# Altium schematic sheet DRV8301_inverter.SchDoc
size 594 x 420 mm; SheetNumber: 8; SheetTotal: 9
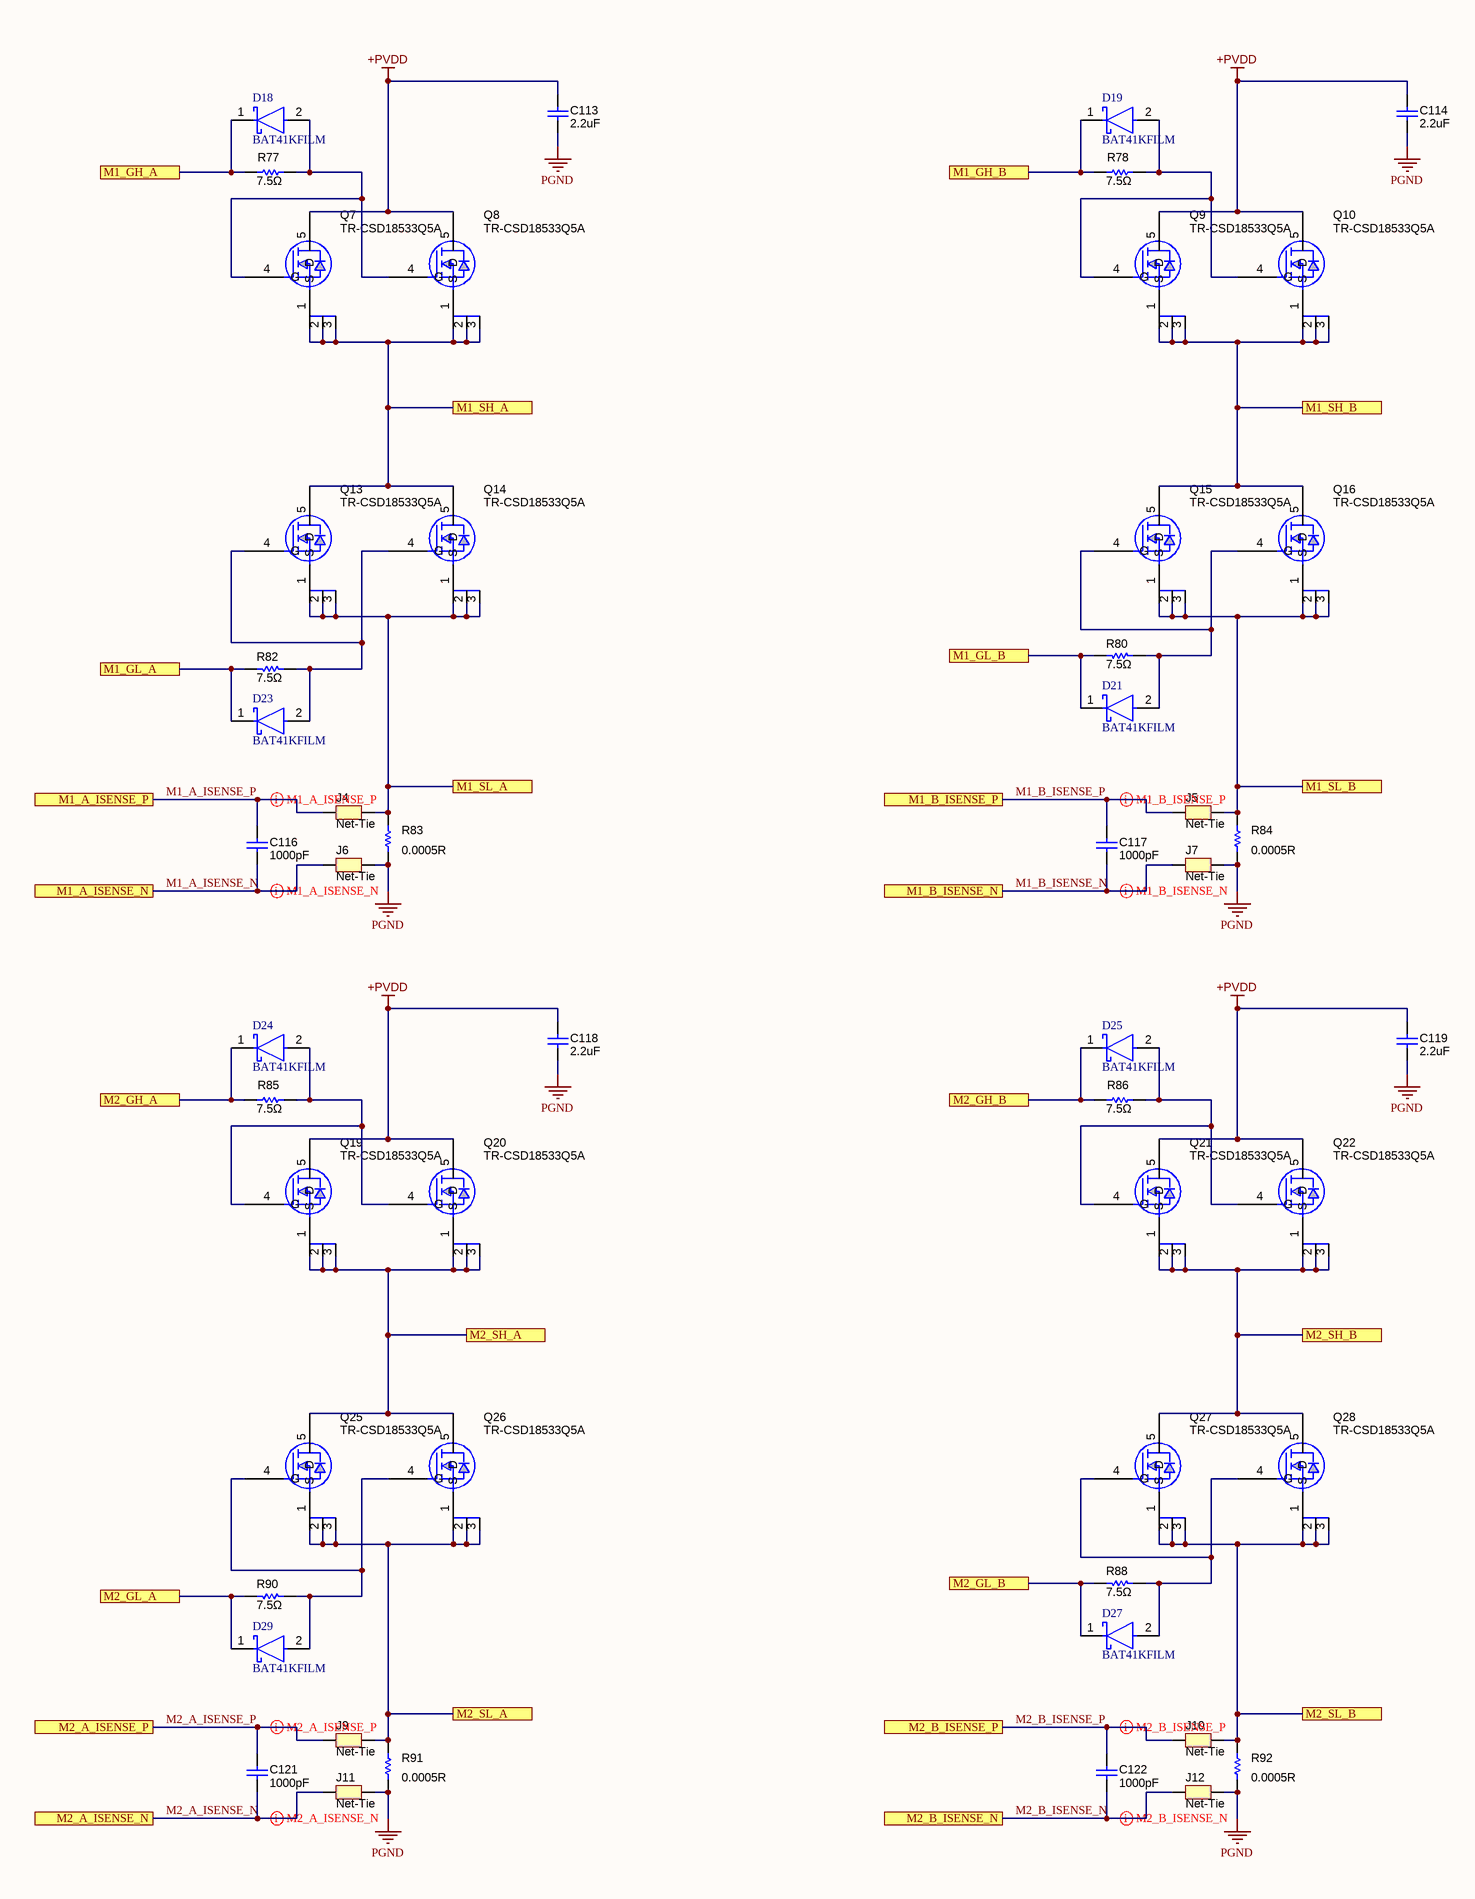
[diagram p0: DRV8301_inverter.SchDoc, left]
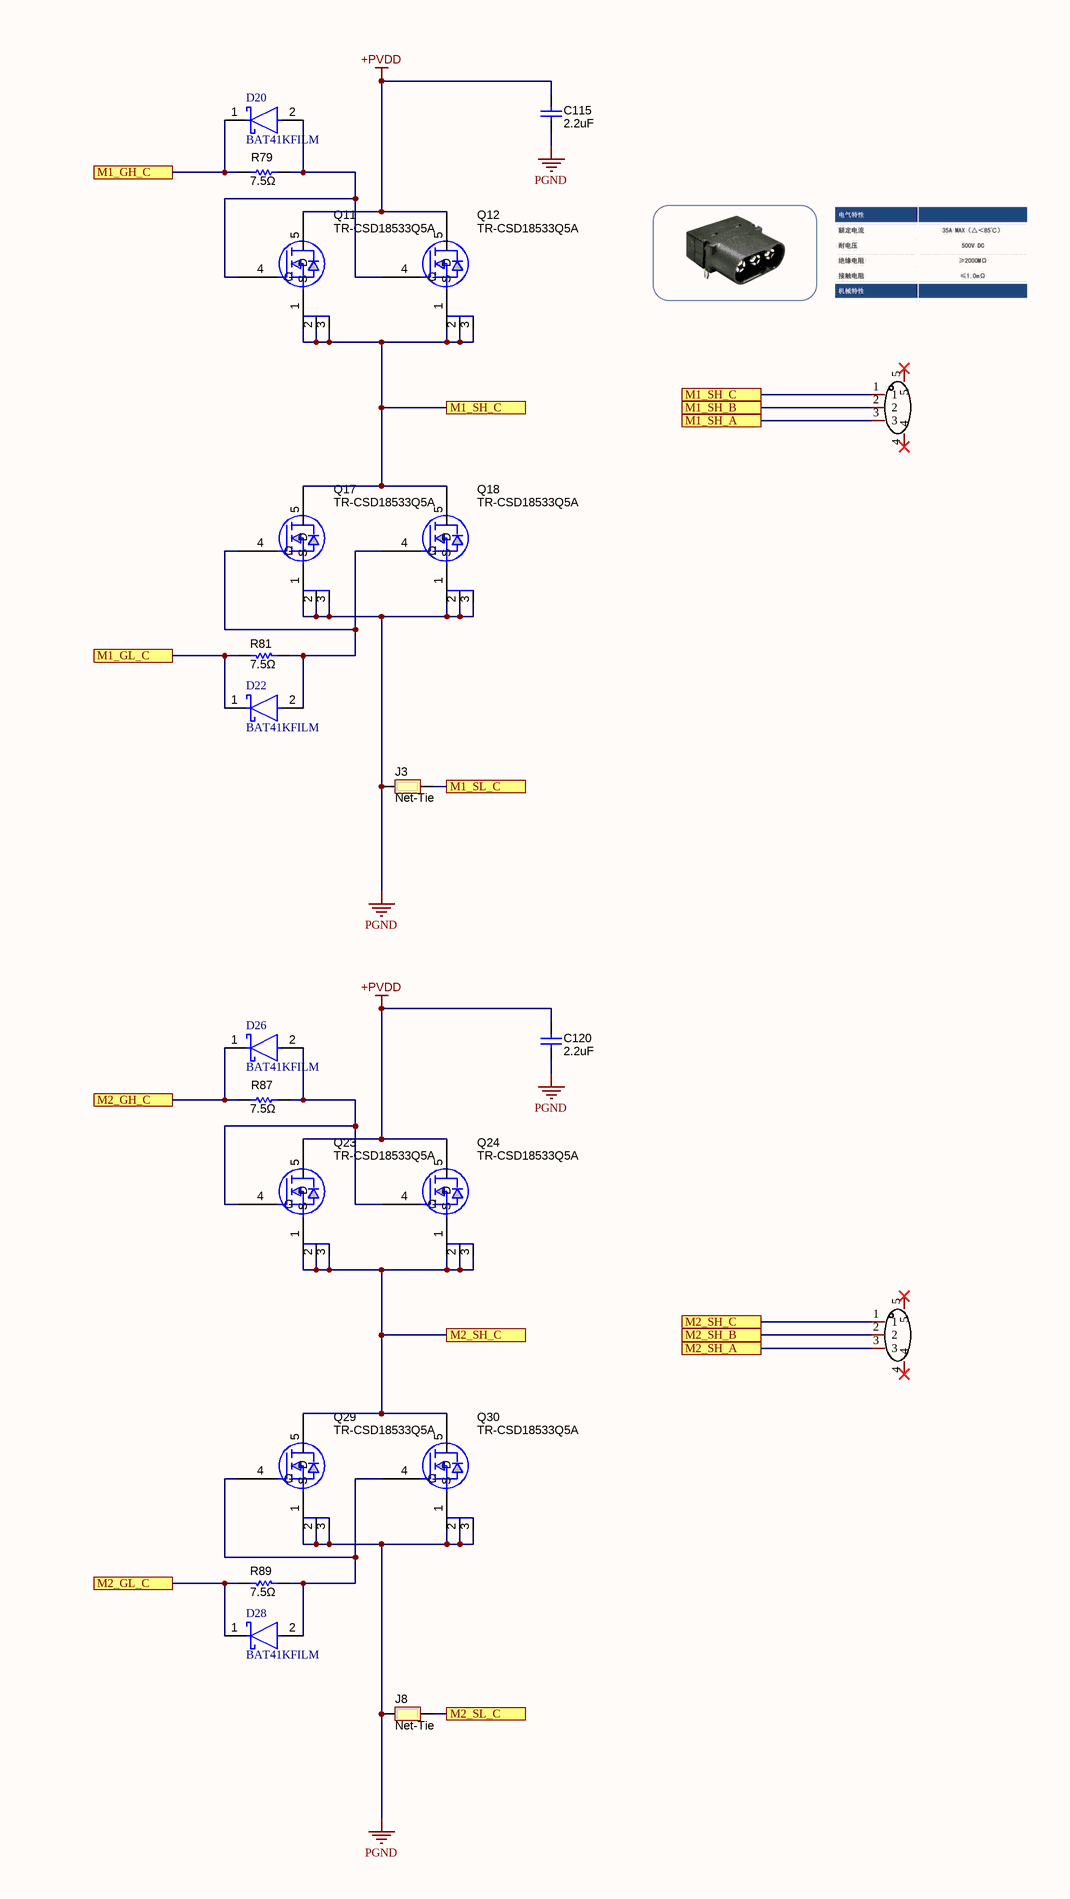
[diagram p1: DRV8301_inverter.SchDoc, right]

## Parts
C113  ValueDisplayed: 2.2uF  [1210L]  (hidden comment: GRM32ER72A225KA35L)
C114  ValueDisplayed: 2.2uF  [1210L]  (hidden comment: GRM32ER72A225KA35L)
C115  ValueDisplayed: 2.2uF  [1210L]  (hidden comment: GRM32ER72A225KA35L)
C116  ValueDisplayed: 1000pF  [0603]  (hidden comment: C0603C102J5GAC)
C117  ValueDisplayed: 1000pF  [0603]  (hidden comment: C0603C102J5GAC)
C118  ValueDisplayed: 2.2uF  [1210L]  (hidden comment: GRM32ER72A225KA35L)
C119  ValueDisplayed: 2.2uF  [1210L]  (hidden comment: GRM32ER72A225KA35L)
C120  ValueDisplayed: 2.2uF  [1210L]  (hidden comment: GRM32ER72A225KA35L)
C121  ValueDisplayed: 1000pF  [0603]  (hidden comment: C0603C102J5GAC)
C122  ValueDisplayed: 1000pF  [0603]  (hidden comment: C0603C102J5GAC)
D18  BAT41KFILM  [FP-SOD-523-MFG]
D19  BAT41KFILM  [FP-SOD-523-MFG]
D20  BAT41KFILM  [FP-SOD-523-MFG]
D21  BAT41KFILM  [FP-SOD-523-MFG]
D22  BAT41KFILM  [FP-SOD-523-MFG]
D23  BAT41KFILM  [FP-SOD-523-MFG]
D24  BAT41KFILM  [FP-SOD-523-MFG]
D25  BAT41KFILM  [FP-SOD-523-MFG]
D26  BAT41KFILM  [FP-SOD-523-MFG]
D27  BAT41KFILM  [FP-SOD-523-MFG]
D28  BAT41KFILM  [FP-SOD-523-MFG]
D29  BAT41KFILM  [FP-SOD-523-MFG]
J3  Net-Tie  [Net-Tie_10mil]  (net tie, no BOM)
J4  Net-Tie  [Net-Tie_10mil]  (net tie, no BOM)
J5  Net-Tie  [Net-Tie_10mil]  (net tie, no BOM)
J6  Net-Tie  [Net-Tie_10mil]  (net tie, no BOM)
J7  Net-Tie  [Net-Tie_10mil]  (net tie, no BOM)
J8  Net-Tie  [Net-Tie_10mil]  (net tie, no BOM)
J9  Net-Tie  [Net-Tie_10mil]  (net tie, no BOM)
J10  Net-Tie  [Net-Tie_10mil]  (net tie, no BOM)
J11  Net-Tie  [Net-Tie_10mil]  (net tie, no BOM)
J12  Net-Tie  [Net-Tie_10mil]  (net tie, no BOM)
Q7  TR-CSD18533Q5A  [QFN5X6MM]
Q8  TR-CSD18533Q5A  [QFN5X6MM]
Q9  TR-CSD18533Q5A  [QFN5X6MM]
Q10  TR-CSD18533Q5A  [QFN5X6MM]
Q11  TR-CSD18533Q5A  [QFN5X6MM]
Q12  TR-CSD18533Q5A  [QFN5X6MM]
Q13  TR-CSD18533Q5A  [QFN5X6MM]
Q14  TR-CSD18533Q5A  [QFN5X6MM]
Q15  TR-CSD18533Q5A  [QFN5X6MM]
Q16  TR-CSD18533Q5A  [QFN5X6MM]
Q17  TR-CSD18533Q5A  [QFN5X6MM]
Q18  TR-CSD18533Q5A  [QFN5X6MM]
Q19  TR-CSD18533Q5A  [QFN5X6MM]
Q20  TR-CSD18533Q5A  [QFN5X6MM]
Q21  TR-CSD18533Q5A  [QFN5X6MM]
Q22  TR-CSD18533Q5A  [QFN5X6MM]
Q23  TR-CSD18533Q5A  [QFN5X6MM]
Q24  TR-CSD18533Q5A  [QFN5X6MM]
Q25  TR-CSD18533Q5A  [QFN5X6MM]
Q26  TR-CSD18533Q5A  [QFN5X6MM]
Q27  TR-CSD18533Q5A  [QFN5X6MM]
Q28  TR-CSD18533Q5A  [QFN5X6MM]
Q29  TR-CSD18533Q5A  [QFN5X6MM]
Q30  TR-CSD18533Q5A  [QFN5X6MM]
R77  value 7.5Ω  [0603L]  (hidden comment: CRCW060310R0JNEA)
R78  value 7.5Ω  [0603L]  (hidden comment: CRCW060310R0JNEA)
R79  value 7.5Ω  [0603L]  (hidden comment: CRCW060310R0JNEA)
R80  value 7.5Ω  [0603L]  (hidden comment: CRCW060310R0JNEA)
R81  value 7.5Ω  [0603L]  (hidden comment: CRCW060310R0JNEA)
R82  value 7.5Ω  [0603L]  (hidden comment: CRCW060310R0JNEA)
R83  value 0.0005R  [2512M]  (hidden comment: CRA2512-FZ-R010ELF)
R84  value 0.0005R  [2512M]  (hidden comment: CRA2512-FZ-R010ELF)
R85  value 7.5Ω  [0603L]  (hidden comment: CRCW060310R0JNEA)
R86  value 7.5Ω  [0603L]  (hidden comment: CRCW060310R0JNEA)
R87  value 7.5Ω  [0603L]  (hidden comment: CRCW060310R0JNEA)
R88  value 7.5Ω  [0603L]  (hidden comment: CRCW060310R0JNEA)
R89  value 7.5Ω  [0603L]  (hidden comment: CRCW060310R0JNEA)
R90  value 7.5Ω  [0603L]  (hidden comment: CRCW060310R0JNEA)
R91  value 0.0005R  [2512M]  (hidden comment: CRA2512-FZ-R010ELF)
R92  value 0.0005R  [2512M]  (hidden comment: CRA2512-FZ-R010ELF)
U25  MR60PW-M.G.B  [CONN-TH_MR60PW]  (value not drawn)
U26  MR60PW-M.G.B  [CONN-TH_MR60PW]  (value not drawn)

## Ports
M1_A_ISENSE_N (see STM32G4_DRV8301_hardware_TOP_V1.0[6D], M1_DRV8301_driver[6D]), M1_A_ISENSE_P (see STM32G4_DRV8301_hardware_TOP_V1.0[6D], M1_DRV8301_driver[6D]), M1_B_ISENSE_N (see STM32G4_DRV8301_hardware_TOP_V1.0[6D], M1_DRV8301_driver[6D]), M1_B_ISENSE_P (see STM32G4_DRV8301_hardware_TOP_V1.0[6D], M1_DRV8301_driver[6D]), M1_GH_A (see STM32G4_DRV8301_hardware_TOP_V1.0[6C], M1_DRV8301_driver[6C]), M1_GH_B (see STM32G4_DRV8301_hardware_TOP_V1.0[6C], M1_DRV8301_driver[6C]), M1_GH_C (see STM32G4_DRV8301_hardware_TOP_V1.0[6C], M1_DRV8301_driver[6D]), M1_GL_A (see STM32G4_DRV8301_hardware_TOP_V1.0[6C], M1_DRV8301_driver[6C]), M1_GL_B (see STM32G4_DRV8301_hardware_TOP_V1.0[6C], M1_DRV8301_driver[6C]), M1_GL_C (see STM32G4_DRV8301_hardware_TOP_V1.0[6D], M1_DRV8301_driver[6D]), M1_SH_A (see STM32G4_DRV8301_hardware_TOP_V1.0[6C], M1_DRV8301_driver[7C]), M1_SH_B (see STM32G4_DRV8301_hardware_TOP_V1.0[6C], M1_DRV8301_driver[7C]), M1_SH_C (see STM32G4_DRV8301_hardware_TOP_V1.0[6D], M1_DRV8301_driver[7D]), M1_SL_A (see STM32G4_DRV8301_hardware_TOP_V1.0[6C], M1_DRV8301_driver[6C]), M1_SL_B (see STM32G4_DRV8301_hardware_TOP_V1.0[6C], M1_DRV8301_driver[6C]), M1_SL_C (see STM32G4_DRV8301_hardware_TOP_V1.0[6D], M1_DRV8301_driver[6D]), M2_A_ISENSE_N (see STM32G4_DRV8301_hardware_TOP_V1.0[6C], M2_DRV8301_driver[7D]), M2_A_ISENSE_P (see STM32G4_DRV8301_hardware_TOP_V1.0[6C], M2_DRV8301_driver[7D]), M2_B_ISENSE_N (see STM32G4_DRV8301_hardware_TOP_V1.0[6C], M2_DRV8301_driver[7D]), M2_B_ISENSE_P (see STM32G4_DRV8301_hardware_TOP_V1.0[6C], M2_DRV8301_driver[7D]), M2_GH_A (see STM32G4_DRV8301_hardware_TOP_V1.0[6B], M2_DRV8301_driver[6C]), M2_GH_B (see STM32G4_DRV8301_hardware_TOP_V1.0[6B], M2_DRV8301_driver[6C]), M2_GH_C (see STM32G4_DRV8301_hardware_TOP_V1.0[6C], M2_DRV8301_driver[6D]), M2_GL_A (see STM32G4_DRV8301_hardware_TOP_V1.0[6B], M2_DRV8301_driver[6C]), M2_GL_B (see STM32G4_DRV8301_hardware_TOP_V1.0[6B], M2_DRV8301_driver[6C]), M2_GL_C (see STM32G4_DRV8301_hardware_TOP_V1.0[6C], M2_DRV8301_driver[6D]), M2_SH_A (see STM32G4_DRV8301_hardware_TOP_V1.0[6B], M2_DRV8301_driver[7C]), M2_SH_B (see STM32G4_DRV8301_hardware_TOP_V1.0[6B], M2_DRV8301_driver[7C]), M2_SH_C (see STM32G4_DRV8301_hardware_TOP_V1.0[6C], M2_DRV8301_driver[7D]), M2_SL_A (see STM32G4_DRV8301_hardware_TOP_V1.0[6B], M2_DRV8301_driver[6C]), M2_SL_B (see STM32G4_DRV8301_hardware_TOP_V1.0[6B], M2_DRV8301_driver[6C]), M2_SL_C (see STM32G4_DRV8301_hardware_TOP_V1.0[6C], M2_DRV8301_driver[6D])

## Nets
+PVDD: C113.1 C114.1 C115.1 C118.1 C119.1 C120.1 Q7.5(D) Q8.5(D) Q9.5(D) Q10.5(D) Q11.5(D) Q12.5(D) Q19.5(D) Q20.5(D) Q21.5(D) Q22.5(D) Q23.5(D) Q24.5(D)
PGND: C113.2 C114.2 C115.2 C118.2 C119.2 C120.2 J3.2 J6.1 J7.1 J8.2 J11.1 J12.1 Q17.1(S) Q17.2 Q17.3 Q18.1(S) Q18.2 Q18.3 Q29.1(S) Q29.2 Q29.3 Q30.1(S) Q30.2 Q30.3 R83.1 R84.1 R91.1 R92.1
M1_A_ISENSE_N: C116.2 J6.2 ; port M1_A_ISENSE_N
M1_A_ISENSE_P: C116.1 J4.2 ; port M1_A_ISENSE_P
M1_B_ISENSE_N: C117.2 J7.2 ; port M1_B_ISENSE_N
M1_B_ISENSE_P: C117.1 J5.2 ; port M1_B_ISENSE_P
M1_GH_A: D18.1(C) R77.1 ; port M1_GH_A
M1_GH_B: D19.1(C) R78.1 ; port M1_GH_B
M1_GH_C: D20.1(C) R79.1 ; port M1_GH_C
M1_GL_A: D23.1(C) R82.1 ; port M1_GL_A
M1_GL_B: D21.1(C) R80.1 ; port M1_GL_B
M1_GL_C: D22.1(C) R81.1 ; port M1_GL_C
M1_SH_A: Q7.1(S) Q7.2 Q7.3 Q8.1(S) Q8.2 Q8.3 Q13.5(D) Q14.5(D) U25.3 ; port M1_SH_A
M1_SH_B: Q9.1(S) Q9.2 Q9.3 Q10.1(S) Q10.2 Q10.3 Q15.5(D) Q16.5(D) U25.2 ; port M1_SH_B
M1_SH_C: Q11.1(S) Q11.2 Q11.3 Q12.1(S) Q12.2 Q12.3 Q17.5(D) Q18.5(D) U25.1 ; port M1_SH_C
M1_SL_A: J4.1 Q13.1(S) Q13.2 Q13.3 Q14.1(S) Q14.2 Q14.3 R83.2 ; port M1_SL_A
M1_SL_B: J5.1 Q15.1(S) Q15.2 Q15.3 Q16.1(S) Q16.2 Q16.3 R84.2 ; port M1_SL_B
M1_SL_C: J3.1 ; port M1_SL_C
M2_A_ISENSE_N: C121.2 J11.2 ; port M2_A_ISENSE_N
M2_A_ISENSE_P: C121.1 J9.2 ; port M2_A_ISENSE_P
M2_B_ISENSE_N: C122.2 J12.2 ; port M2_B_ISENSE_N
M2_B_ISENSE_P: C122.1 J10.2 ; port M2_B_ISENSE_P
M2_GH_A: D24.1(C) R85.1 ; port M2_GH_A
M2_GH_B: D25.1(C) R86.1 ; port M2_GH_B
M2_GH_C: D26.1(C) R87.1 ; port M2_GH_C
M2_GL_A: D29.1(C) R90.1 ; port M2_GL_A
M2_GL_B: D27.1(C) R88.1 ; port M2_GL_B
M2_GL_C: D28.1(C) R89.1 ; port M2_GL_C
M2_SH_A: Q19.1(S) Q19.2 Q19.3 Q20.1(S) Q20.2 Q20.3 Q25.5(D) Q26.5(D) U26.3 ; port M2_SH_A
M2_SH_B: Q21.1(S) Q21.2 Q21.3 Q22.1(S) Q22.2 Q22.3 Q27.5(D) Q28.5(D) U26.2 ; port M2_SH_B
M2_SH_C: Q23.1(S) Q23.2 Q23.3 Q24.1(S) Q24.2 Q24.3 Q29.5(D) Q30.5(D) U26.1 ; port M2_SH_C
M2_SL_A: J9.1 Q25.1(S) Q25.2 Q25.3 Q26.1(S) Q26.2 Q26.3 R91.2 ; port M2_SL_A
M2_SL_B: J10.1 Q27.1(S) Q27.2 Q27.3 Q28.1(S) Q28.2 Q28.3 R92.2 ; port M2_SL_B
M2_SL_C: J8.1 ; port M2_SL_C
NetD18_2: D18.2(A) Q7.4(G) Q8.4(G) R77.2
NetD19_2: D19.2(A) Q9.4(G) Q10.4(G) R78.2
NetD20_2: D20.2(A) Q11.4(G) Q12.4(G) R79.2
NetD21_2: D21.2(A) Q15.4(G) Q16.4(G) R80.2
NetD22_2: D22.2(A) Q17.4(G) Q18.4(G) R81.2
NetD23_2: D23.2(A) Q13.4(G) Q14.4(G) R82.2
NetD24_2: D24.2(A) Q19.4(G) Q20.4(G) R85.2
NetD25_2: D25.2(A) Q21.4(G) Q22.4(G) R86.2
NetD26_2: D26.2(A) Q23.4(G) Q24.4(G) R87.2
NetD27_2: D27.2(A) Q27.4(G) Q28.4(G) R88.2
NetD28_2: D28.2(A) Q29.4(G) Q30.4(G) R89.2
NetD29_2: D29.2(A) Q25.4(G) Q26.4(G) R90.2

Not connected (* = marked no-connect by the designer): U25 4* 5*; U26 4* 5*

## Layout directives
differential pair: M1_A_ISENSE_N, M1_A_ISENSE_P, M1_B_ISENSE_N, M1_B_ISENSE_P, M2_A_ISENSE_N, M2_A_ISENSE_P, M2_B_ISENSE_N, M2_B_ISENSE_P

## Notes on the sheet
- DWG NO:
- REV:
- THIS DOCUMENT AND THE DATA DISCLOSED HEREIN OR
- HEREWITH IS THE PROPERTY OF ALTIUM LIMITED AND MAY
- BE FREELY DISTRIBUTED IN WHOLE. NO RIGHTS ARE
- RESERVED OR EXPRESS OR IMPLIED WARANTEE GIVEN.
- REVISION
- DESCRIPTION
- DATE
- APPROVED
- ENG:
- APPROVALS
- PROJECT
- DSN:
- CHK:
- REFERENCE DOCUMENTS
- PROJECT REVISION:
- TITLE
- DOCUMENT REVISION:
- DESIGN ITEM:
- BOM:
- FAB DWG:
- PCB DWG:
- ASSY DWG:
- SCALE:
- A2
- SIZE
- CAGE CODE
- FILE NAME
- DWG NO.
- SHEET
- OF
- REV

## Library data of the parts
C113-C115 C118-C120 = GRM32ER72A225KA35L: CAP, CERM, 2.2uF, 100V, +/-10%, X7R, 1210; Manufacturer: MuRata; Polarized: N; CompType: Capacitor; U/M: EA; Cap_F: 0.0000022; Tolerance_%: 10; ESR_Ohm: 0.007; Value1: 0.007 ohm; VDC_V: 100; IRMS_A: 4.4; TaMin_C: -55; TaMax_C: 125; Cap_Case: 1210; SymbolVersion: 2008-07-09; Value: 2.2uF; PartNumber: GRM32ER72A225KA35L; PackageReference: 1210; RoHS: Y; Value2: 100V; MountType: SMT; Technology: Ceramic; TempCo: X7R; Published: 2008-06-19; Publisher: Texas Instruments; LatestRevisionDate: 2013-05-24; LatestRevisionNote: Changed publisher; ComponentLink1Description: Datasheet link; ComponentLink1URL: http://search.murata.co.jp/Ceramy/PnsearchViewAction.do?HnOFG=ON&HnNFG=ON&SEL_CNT=50&sLang=en&sKey=GRM32ER72A225KA35L&x=9&y=9&search=startwith; Supplier 1: Digi-Key; Supplier Part Number 1: 490-3385-1-ND; Supplier 2: Mouser; Supplier Part Number 2: 81-GRM32ER72A225KA35; Supplier 3: Farnell; Supplier Part Number 3: 1735547
C116 C117 C121 C122 = C0603C102J5GAC: CAP, CERM, 1000pF, 50V, +/-5%, C0G/NP0, 0603; Manufacturer: Kemet; Polarized: N; CompType: Capacitor; U/M: EA; Cap_F: 0.000000001; Tolerance_%: 5; Value1: Unknown; VDC_V: 50; TaMin_C: -55; TaMax_C: 125; SymbolVersion: 2008-07-09; Value: 1000pF; PartNumber: C0603C102J5GAC; PackageReference: 0603; RoHS: Y; Value2: 50V; MountType: SMT; Technology: Ceramic; TempCo: C0G/NP0; Cap_Case: 0603; Published: 2008-06-19; Publisher: Texas Instruments; LatestRevisionDate: 2013-05-24; LatestRevisionNote: Changed publisher; ComponentLink1Description: Datasheet link; ComponentLink1URL: http://www.kemet.com/kemet/web/homepage/kechome.nsf/vapubfiles/F3102_Y5V.pdf/$file/F3102_Y5V.pdf; Supplier 1: Farnell; Supplier Part Number 1: 317202
D18-D29 = CMP-12187-000015-1: DIODE SCHOTTKY 100V 200MA SOD523; Manufacturer: STMicroelectronics; Max Junction Temp: +150°C; Max Surge Forward Current: 1A; Capacitance: 3pF; Peak Reverse Current: 0.1uA; Value: 3pF; Automotive: No; Max Repetitive Reverse Voltage: 100V; Octopart: https://octopart.com/bat41kfilm-stmicroelectronics-658186; Temperature Range High: +150°C; Digikey Description: DIODE SCHOTTKY 100V 200MA SOD523; Device Class L2: Diodes; Forward Current: 200mA; Device Class L1: Discrete Semiconductors; Lead Free: Yes; Temperature: to +150°C; Manufacturer Part Number: BAT41KFILM; Mouser Description: Schottky Diodes & Rectifiers schottky diode; Height: 0.7mm; RoHS: TRUE; ComponentLink2Description: Datasheet; Device Class L3: Schottky Diodes; Category: Diode; Package: SOD-523; ComponentLink2URL: https://www.st.com/resource/en/datasheet/bat41.pdf
J3-J12 = Net-Tie: Single point connection between nets.; SymbolCreator: codlsc; SymbolVersion: 2009-07-01; MountType: SMT; Publisher: Texas Instruments; LatestRevisionDate: 2013-05-15; LatestRevisionNote: Added Alternate PartNumber and Alternate Manufacturer parameters to appropriate components.
Q7-Q30 = TR-CSD18533Q5A: MOSFET, N-Chan, 60V, 18A, 6.1 mOhm; Manufacturer: TI; Area: 86800; SymbolVersion: 04/25/2012 11:24:36; PartNumber: CSD18533Q5A; ComponentLink1URL: \\vette02\pmp_pcb\pcad_pdf's\CSD18533Q5A.pdf; PackageReference: QFN-8 POWER; Value: CSD18533Q5A; ComponentHeight: *; ComponentLink1Description: AEO Datasheet Link
R77-R82 R85-R90 = CRCW060310R0JNEA: RES, 7.5 ohm, 5%, 0.1W, 0603; Manufacturer: Vishay-Dale; CompType: Resistor; Res_ohm: 10; Value_Code: 10R0; Tolerance_%: 5; Power_W: 0.1; VDC_V: 75; TempCo: 200 ppm/C; EIA_Code: E24; U/M: EA; SymbolVersion: 2009-05-29; PartNumber: CRCW060310R0JNEA; PackageReference: 0603; RoHS: Y; Value1: 5%; Value2: 0.1W; MountType: SMT; Technology: Thick Film; Published: 2008-06-26; Publisher: Texas Instruments; LatestRevisionDate: 2013-01-08; ComponentLink1Description: Datasheet link; ComponentLink1URL: http://www.vishay.com/docs/20035/dcrcwe3.pdf; Supplier 1: Digi-Key; Supplier Part Number 1: 541-10GCT-ND; Supplier 2: Mouser; Supplier Part Number 2: 71-CRCW0603J-10-E3; Supplier 3: Farnell; Supplier Part Number 3: 1514712
R83 R84 R91 R92 = CRA2512-FZ-R010ELF: RES, 0.01 ohm, 1%, 3W, 2512; Manufacturer: Bourns; CompType: Resistor; Res_ohm: 0.01; Value_Code: R010; Tolerance_%: 1; Power_W: 3; TempCo: 75 ppm/C; EIA_Code: E96; U/M: EA; SymbolVersion: 2009-05-29; PartNumber: CRA2512-FZ-R010ELF; PackageReference: 2512; RoHS: Y; Value1: 1%; Value2: 3W; MountType: SMT; Technology: Metal Film; Published: 2008-06-26; Publisher: Texas Instruments; LatestRevisionDate: 2013-05-25; ComponentLink1Description: Datasheet link; ComponentLink1URL: http://www.bourns.com/data/global/pdfs/CRA.pdf; Supplier 1: Digi-Key; Supplier Part Number 1: CRA2512-FZ-R010ELFCT-ND; Supplier 2: Mouser; Supplier Part Number 2: 652-CRA2512FZR010ELF; Supplier 3: Farnell; Supplier Part Number 3: 1435947
U25 U26 = MR60PW-M.G.B: Manufacturer: AMASS(艾迈斯); Add into BOM: yes; Symbol: MR60PW-M.G.B; Device: MR60PW-M.G.B; LCSC Part Name: MR60PW 20A三芯PCB弯插公镀金黑色; Supplier Part: C19268044; Manufacturer Part: MR60PW-M.G.B; Supplier Footprint: -; JLCPCB Part Class: Extended Part; Datasheet: https://atta.szlcsc.com/upload/public/pdf/source/20231221/53B4DC893AF29571B873350396E957CB.pdf; Supplier: LCSC; Convert to PCB: yes